# Altium project PCB_Project_1.PrjPcb
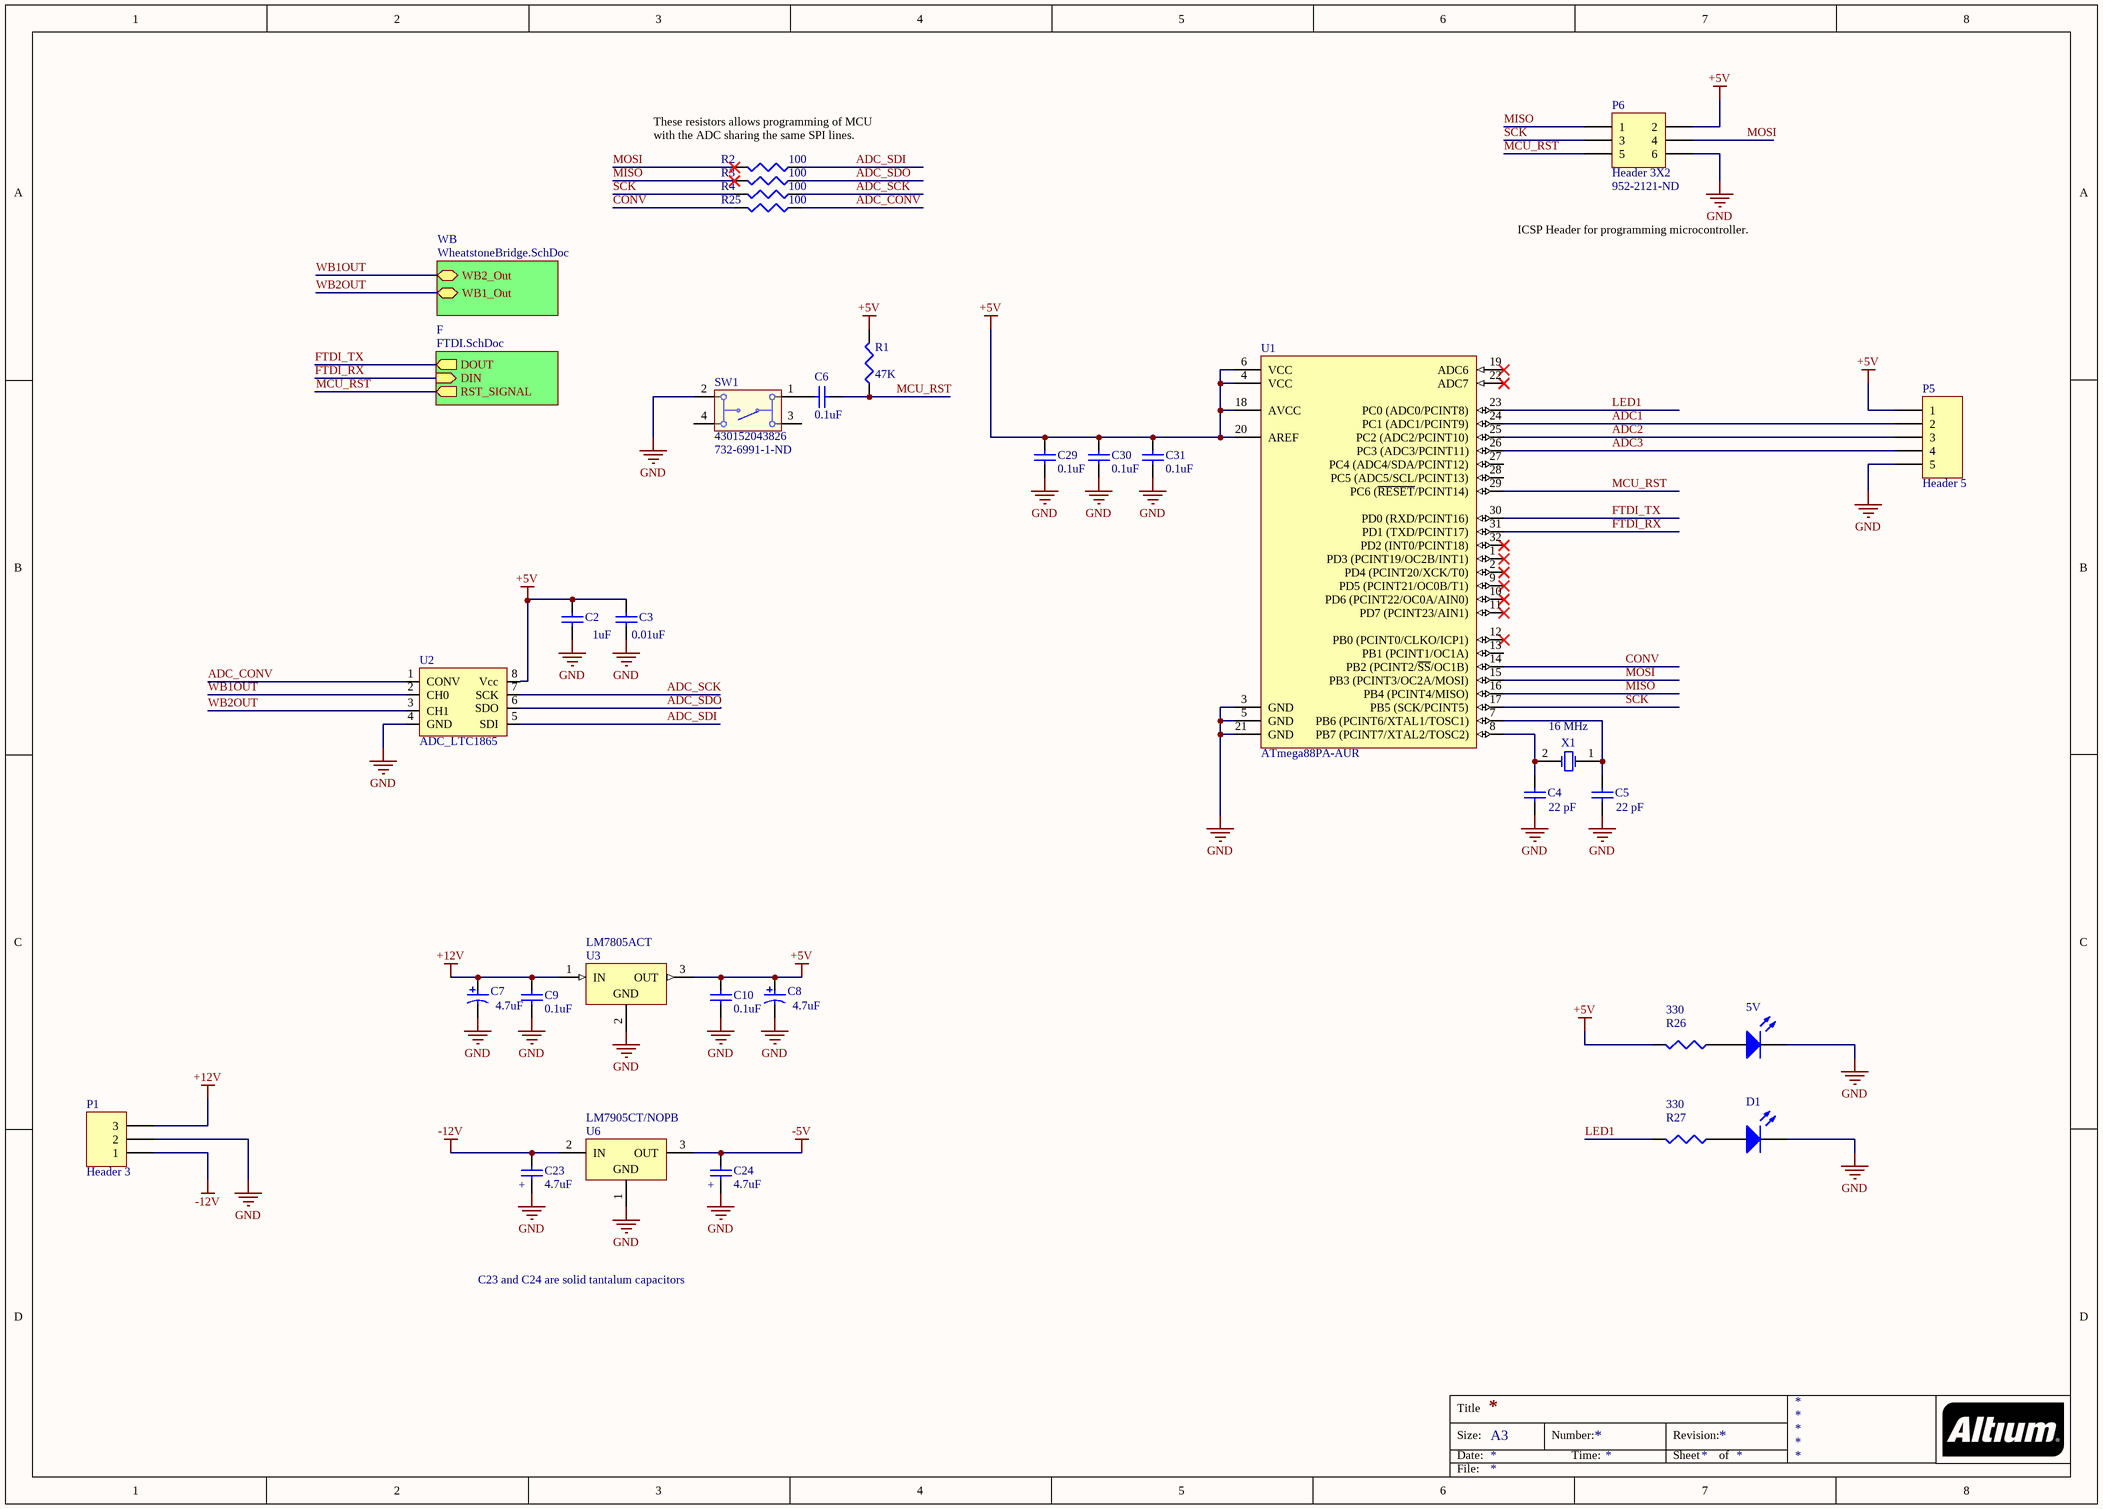
[diagram p0: Sheet1.SchDoc]
4 sheets, 74 parts. Net scope: hierarchical (ports join the sheet entries above them; power ports are global).
Board file: DualWheatstoneAmplifierV1.PcbDoc
Sheets:
  Sheet1.SchDoc
    WB = WheatstoneBridge.SchDoc
      Amp1 = WheatstonePrimaryAmplifier.SchDoc
      Amp2 = WheatstonePrimaryAmplifier.SchDoc
    F = FTDI.SchDoc

## Sheet Sheet1.SchDoc
size A3; PageSetup: Record=PageOptions|CenterHorizontal=True|CenterVertical=True|PrintScale=1.00|XCorrection=1.00|YCorrection=1.00|PrintKind=1|BorderSize=5000000|LeftOffset=0|BottomOffset=0|Orientation=2|PaperLength=1000|PaperWidth=1000|Scale=100|PaperSource=7|PrintQuality=-3|MediaType=1|DitherType=10|PrintScaleMode=1|PaperKind=A4|PaperIndex=9

### Parts
5V  150060RS75000  [0603_A]  (value not drawn)
C2  value 1uF  [1608[0603]]  (hidden comment: Cap Semi)
C3  value 0.01uF  [1608[0603]]  (hidden comment: Cap Semi)
C4  value 22 pF  [1608[0603]]  (hidden comment: Cap Semi)
C5  value 22 pF  [1608[0603]]  (hidden comment: Cap Semi)
C6  value 0.1uF  [1608[0603]]  (hidden comment: Cap Semi)
C7  Capacitance: 4.7uF  [AVX-TAJ-A-2_N]  (hidden comment: TAJA475K016RNJ)
C8  Capacitance: 4.7uF  [AVX-TAJ-A-2_N]  (hidden comment: TAJA475K016RNJ)
C9  value 0.1uF  [1608[0603]]  (hidden comment: Cap Semi)
C10  value 0.1uF  [1608[0603]]  (hidden comment: Cap Semi)
C23  value 4.7uF  [1608[0603]]  (hidden comment: Cap Semi)
C24  value 4.7uF  [1608[0603]]  (hidden comment: Cap Semi)
C29  value 0.1uF  [1608[0603]]  (hidden comment: Cap Semi)
C30  value 0.1uF  [1608[0603]]  (hidden comment: Cap Semi)
C31  value 0.1uF  [1608[0603]]  (hidden comment: Cap Semi)
D1  150060RS75000  [0603_A]  (value not drawn)
P1  Header 3  [HDR1X3]
P5  Header 5  [HDR1X5]
P6  Header 3X2  Supplier Part Number 1: 952-2121-ND  [HDR2X3]
R1  value 47K  [J1-0603]  (hidden comment: Res3)
R2  value 100  [J1-0603]  (hidden comment: Res3)
R3  value 100  [J1-0603]  (hidden comment: Res3)
R4  value 100  [J1-0603]  (hidden comment: Res3)
R25  value 100  [J1-0603]  (hidden comment: Res3)
R26  value 330  [J1-0603]  (hidden comment: Res3)
R27  value 330  [J1-0603]  (hidden comment: Res3)
SW1  430152043826  Supplier Part Number 1: 732-6991-1-ND  [430152043826]
U1  ATmega88PA-AUR  [32A_N]
U2  ADC_LTC1865  [LTC1865_SOIC8]
U3  LM7805ACT  [FAIR-TO-220-3]
U6  LM7905CT/NOPB  [NDE0003A]
X1  Frequency: 16 MHz  [ABRA-ABLS2-2_V]  (hidden comment: ABLS2-16.000MHZ-D4Y-T)

### Sub-sheets
F = FTDI.SchDoc: DOUT (out), RST_SIGNAL (out), DIN (in)
WB = WheatstoneBridge.SchDoc: WB1_Out, WB2_Out

### Nets
+5V: C2.1 C3.1 C8.1 C10.1 C29.1 C30.1 C31.1 P5.1 P6.2 R1.2 R26.2 U1.4(VCC) U1.6(VCC) U1.18(AVCC) U1.20(AREF) U2.8(Vcc) U3.3(OUT)
+12V: C7.1 C9.1 P1.3 U3.1(IN)
-5V: C24.1 U6.3(OUT)
-12V: C23.1 P1.1 U6.2(IN)
GND: 5V.1(K) C2.2 C3.2 C4.1 C5.1 C7.2 C8.2 C9.2 C10.2 C23.2 C24.2 C29.2 C30.2 C31.2 D1.1(K) P1.2 P5.5 P6.6 SW1.2 U1.3(GND) U1.5(GND) U1.21(GND) U2.4(GND) U3.2(GND) U6.1(GND)
ADC1: P5.2 U1.24(PC1_(ADC1/PCINT9))
ADC2: P5.3 U1.25(PC2_(ADC2/PCINT10))
ADC3: P5.4 U1.26(PC3_(ADC3/PCINT11))
ADC_CONV: R25.1 U2.1(CONV)
ADC_SCK: R4.1 U2.7(SCK)
ADC_SDI: R2.1 U2.5(SDI)
ADC_SDO: R3.1 U2.6(SDO)
CONV: R25.2 U1.14(PB2_(PCINT2/~{SS}/OC1B))
FTDI_RX: U1.31(PD1_(TXD/PCINT17)) ; sheet F/DIN
FTDI_TX: U1.30(PD0_(RXD/PCINT16)) ; sheet F/DOUT
LED1: R27.2 U1.23(PC0_(ADC0/PCINT8))
MCU_RST: C6.1 P6.5 R1.1 U1.29(PC6_(~{RESET}/PCINT14)) ; sheet F/RST_SIGNAL  [project net FTDI_RST]
MISO: P6.1 R3.2 U1.16(PB4_(PCINT4/MISO))
MOSI: P6.4 R2.2 U1.15(PB3_(PCINT3/OC2A/MOSI))
SCK: P6.3 R4.2 U1.17(PB5_(SCK/PCINT5))
WB1OUT: U2.2(CH0) ; sheet WB/WB2_Out
WB2OUT: U2.3(CH1) ; sheet WB/WB1_Out  [project net WB1]
Net5V_2: 5V.2(A) R26.1
NetC4_2: C4.2 U1.8(PB7_(PCINT7/XTAL2/TOSC2)) X1.2(X2)
NetC5_2: C5.2 U1.7(PB6_(PCINT6/XTAL1/TOSC1)) X1.1(X1)
NetC6_2: C6.2 SW1.1
NetD1_2: D1.2(A) R27.1

Not connected (* = marked no-connect by the designer): SW1 3 4; U1 1(PD3_(PCINT19/OC2B/INT1))* 2(PD4_(PCINT20/XCK/T0))* 9(PD5_(PCINT21/OC0B/T1))* 10(PD6_(PCINT22/OC0A/AIN0))* 11(PD7_(PCINT23/AIN1))* 12(PB0_(PCINT0/CLKO/ICP1))* 13(PB1_(PCINT1/OC1A)) 19(ADC6)* 22(ADC7)* 27(PC4_(ADC4/SDA/PCINT12)) 28(PC5_(ADC5/SCL/PCINT13)) 32(PD2_(INT0/PCINT18))*

### Notes on the sheet
- These resistors allows programming of MCU with the ADC sharing the same SPI lines.
- ICSP Header for programming microcontroller.
- (near C23) +
- (near C24) +
- C23 and C24 are solid tantalum capacitors
- Title
- Size:
- Date:
- A3
- Number:
- Time:
- Revision:
- Sheet
- of
- File:

### Library data of the parts
5V D1 = CMP-1426-00001-1: SMD mono-color Chip LED, WL-SMCW, Red; Manufacturer: Wuerth Elektronik; Color: Red; PackageReference: 0603_A; ComponentLink2URL: http://katalog.we-online.com/led/datasheet/150060RS75000.pdf; ComponentLink1URL: http://www.we-online.com; ComponentLink1Description: Manufacturer URL; ComponentLink2Description: Datasheet; PartNumber: 150060RS75000; Supplier 1: Digi-Key; Supplier Part Number 1: 732-4978-1-ND
C2-C6 C9 C10 C23 C24 C29-C31 = Cap Semi: Capacitor (Semiconductor SIM Model); Published: 8-Jun-2000; LatestRevisionDate: 29-May-2009; LatestRevisionNote: IPC-7351 Footprint Added.; PackageReference: C1206; Publisher: Altium Limited; PackageDescription: Chip Capacitor; Supplier 1: Digi-Key
  C2 C3 C6 C9 C10 C23 C24 C29-C31: Supplier Part Number 1: 490-10901-1-ND
  C4 C5: Supplier Part Number 1: 478-1166-1-ND
C7 C8 = CMP-2100-03687-1: Standard Tantalum, 4.7 uF, +/- 10%, 16 V, -55 to 125 degC, 2-Pin SMD (1206), RoHS, Tape and Reel; Manufacturer: AVX; Dissipation Factor: 6%; Voltage Rating: 16V; Polarity: Polar; Resistance: 4Ohm; Leakage Current: 800nA; Lead Free: LeadFree; Radiation Hardening: No; Depth: 1.6mm; Package Description: 2-Pin Surface Mount Device, Body 3.2 x 1.65 mm; Package Quantity: 1; Max Operating Temperature: 125degC; Case/Package: 1206; Min Operating Temperature: -55degC; Datasheet URL: http://datasheets.avx.com/TAJ.pdf; Termination: SMD/SMT; Length: 3.2mm; Manufacturer URL: http://www.avx.com/; Height - Seated (Max): 0.071inch; Packaging: TapeandReel; Package Reference: TAJ-A-2; RoHSCompliant: True; Datasheet Version: 42401.0; Voltage Rating (DC): 16V; REACH SVHC: NoSVHC; ESR (Equivalent Series Resistance): 4Ohm; Tolerance: 10%; Case Code (Metric): 3216; Voltage: 16V; Height: 1.6mm; Number of Pins: 2; Lead Pitch: 1.1mm; Dielectric Material: Tantalum; Case Code (Imperial): 1206; Width: 1.6mm
P1 = Header 3: Header, 3-Pin; LatestRevisionDate: 17-Jul-2002; LatestRevisionNote: Re-released for DXP Platform.; Publisher: Altium Limited
P5 = Header 5: Header, 5-Pin; LatestRevisionDate: 17-Jul-2002; LatestRevisionNote: Re-released for DXP Platform.; Publisher: Altium Limited
P6 = Header 3X2: Header, 3-Pin, Dual row; LatestRevisionDate: 17-Jul-2002; LatestRevisionNote: Re-released for DXP Platform.; Publisher: Altium Limited; Supplier 1: Digi-Key
R1-R4 R25-R27 = Res3: Resistor; Published: 8-Jun-2000; LatestRevisionDate: 29-May-2009; LatestRevisionNote: IPC-7351 Footprint Added.; PackageReference: J1-0603; Publisher: Altium Limited; PackageDescription: Chip Resistor; Supplier 1: Digi-Key
  R1: Supplier Part Number 1: 311-47.0KHRCT-ND
  R2-R4 R25: Supplier Part Number 1: 311-100HRCT-ND
  R26 R27: Supplier Part Number 1: 311-330HRCT-ND
SW1 = CMP-1452-00001-1: WS-TASV SMD Tact Switch 6X6 mm; Manufacturer: Wuerth Elektronik; NoPins: 04; PartNumber: 430152043826; ComponentLink2Description: Datasheet; ComponentLink1Description: Manufacturer URL; ComponentLink1URL: http://www.we-online.com; ComponentLink2URL: http://katalog.we-online.de/em/datasheet/4301x2.pdf; PackageReference: 430152043826; Supplier 1: Digi-Key
U1 = CMP-0095-00212-2: 8-bit AVR Microcontroller, 8KB Flash, 512 Bytes EEPROM, 1KB SRAM, 32-pin TQFP, Industrial Grade (-40°C to 85°C), Reel; ComponentLink1URL: http://www.atmel.com/; DatasheetVersion: revD, May-2011; ComponentLink3Description: ATmega48A/48PA/88A/88PA/168A/168PA/328/328P Summary; PackageDescription: 32-Lead, 7x7x1.0 mm Body, 0.8mm Lead Pitch, Thin Profile Plastic Quad Flat Package (TQFP); ComponentLink1Description: Manufacturer URL; ComponentLink3URL: http://www.atmel.com/dyn/resources/prod_documents/8271S.pdf; ComponentLink2URL: http://www.atmel.com/dyn/resources/prod_documents/doc8271.pdf; PackageReference: 32A; RevisionNote: DatasheetVersion & PackageVersion updated. URLs added.; ComponentLink2Description: ATmega48A/48PA/88A/88PA/168A/168PA/328/328P Datasheet; Code_JEDEC: MS-026-ABA; PackageVersion: revC, Oct-2010
U3 = CMP-2000-04937-1: Positive Voltage Regulator, 5 V, 1 A, 0 to 125 degC, 3-Pin TO-220, RoHS, Tube; Manufacturer: Fairchild; Number of Outputs: 1; Typical Dropout Voltage @ Current: 2V@1A; Output Type: Fixed; Output Voltage: 5V; Quiescent Current: 6mA; Dropout Voltage Measurement Current: 1A; Line Regulation: 50mV; Maximum Input Voltage: 35V; Regulator Function: Linear; Load Regulation: 100mV; Package Type: TO-220; Mounting Type: ThroughHole; Height: 16.51mm; Maximum Operating Temperature: +125degC; Datasheet Version: Rev. 1.0.1, 05/2006; Package Reference: TO-220; Minimum Operating Temperature: 0degC; Manufacturer URL: https://www.fairchildsemi.com/; Package URL: https://www.fairchildsemi.com/package-drawings/TO/TO220B03.pdf; Length: 10.67mm; Series: LM78xx; Dimensions: 10.67x4.83x16.51mm; Polarity: Positive; Maximum Output Current: 1A; Pin Count: 3; Width: 4.83mm; Package Description: 3-Pin Through Hole Device, Body 10 x 4.5 mm, Pitch 2.54 mm; Datasheet URL: https://datasheet.ciiva.com/5816/1359194-5816420.pdf
U6 = CMP-0062-02481-3: 3-Terminal Negative Regulator, 3-pin TO-220, Pb-Free; Manufacturer: Texas Instruments; PackageTopMarking: NSUZXYTTE#*LM7905CT; CompType: LDO IC; PowerWise: N; PackageDescription: TO-220, Molded, 3 Lead, Straight; ComponentLink1Description: Datasheet URL; ComponentLink1URL: http://www.ti.com/general/docs/lit/getliterature.tsp?genericPartNumber=LM7905&fileType=pdf; PackageReference: NDE0003A; RoHS: Y; PinCount: 3
X1 = CMP-0277-00002-1: Low Profile Surface Mount Microprocessor Crystal, 16.000 MHz +/-30 ppm, 180 Ohm, -40 to 85 degC, 2-Pin 11.4 x 4.7 x 3.3 mm SMD, RoHS, Tape and Reel; Manufacturer: Abracon; Operation Mode: Fundamental or 3rd Overtone; Shunt Capacitance: 7 pF Max.; ESR: 180 Ohm; Load Capacitance: 18 pF; Mounting Technology: Surface Mount; PackageDescription: 2-Pin SMD, Body 11.4 x 4.7 mm, Height 3.3 mm; ComponentLink1URL: http://www.abracon.com/; Freq. Stability: +/- 30 ppm; ComponentLink2Description: Datasheet; PartNumber: ABLS2-16.000MHZ-D4Y-T; Operating Temp. Range: -40 to 85 degC; Packing: Tape and Reel; RoHS: TRUE; PackageReference: ABLS2-2; DatasheetVersion: Rev. 03.31.11; Freq. Tolerance: +/- 30 ppm; ComponentLink2URL: http://www.abracon.com/Resonators/ABLS2.pdf; ComponentLink1Description: Manufacturer URL; Supplier 1: Digi-Key; Supplier Part Number 1: 535-9875-1-ND

## Sheet WheatstoneBridge.SchDoc
size A3
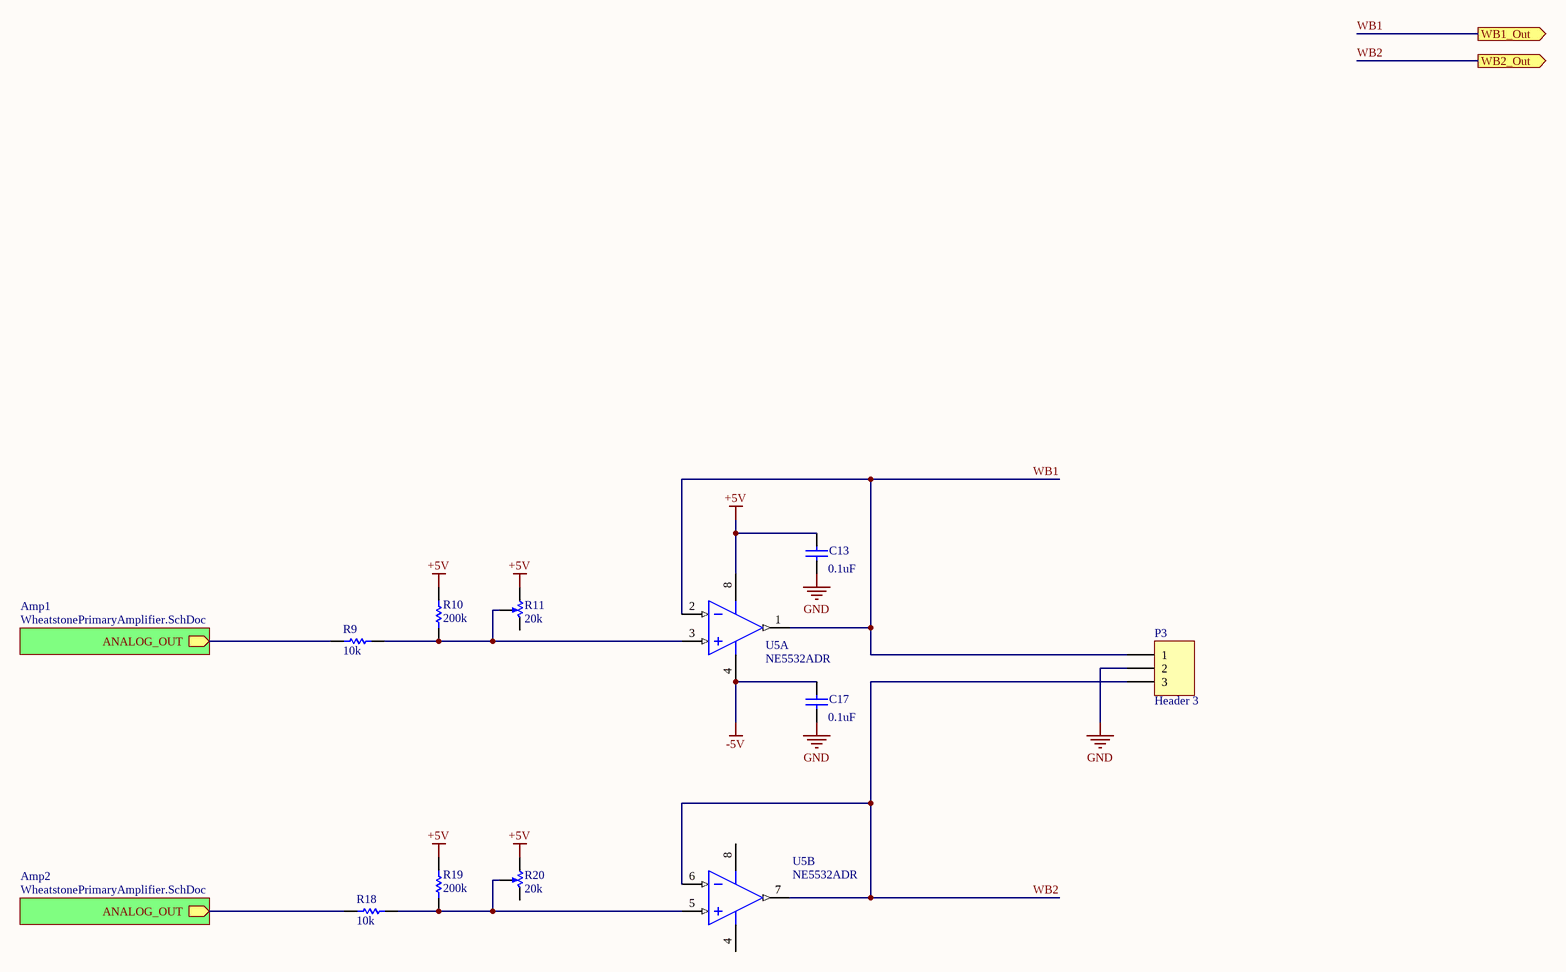
[diagram p1: WheatstoneBridge.SchDoc]

### Parts
C13  value 0.1uF  [1608[0603]]  (hidden comment: Cap Semi)
C17  value 0.1uF  [1608[0603]]  (hidden comment: Cap Semi)
P3  Header 3  [HDR1X3]
R9  10k  [RESC1608X55X25ML10T15]
R10  200k  [RESC1608X55X25ML10T15]
R11  20k  [Trimpot_Cut_tape_3.4x3.4x2]
R18  10k  [RESC1608X55X25ML10T15]
R19  200k  [RESC1608X55X25ML10T15]
R20  20k  [Trimpot_Cut_tape_3.4x3.4x2]
U5  NE5532ADR  [D0008A_M]  (parts A,B of 2)

### Sub-sheets
Amp1 = WheatstonePrimaryAmplifier.SchDoc: ANALOG_OUT (out)
Amp2 = WheatstonePrimaryAmplifier.SchDoc: ANALOG_OUT (out)

### Ports
WB1_Out (out), WB2_Out (out)

### Nets
+5V: C13.1 R10.1 R11.1 R19.1 R20.1 U5.8(VCC+)
-5V: C17.1 U5.4(VCC-)
GND: C13.2 C17.2 P3.2
ANALOG_OUT: R9.2 ; sheet Amp1/ANALOG_OUT
ANALOG_OUT: R18.2 ; sheet Amp2/ANALOG_OUT  [a separate net that carries the same name]
WB1: P3.1 U5.1(OUT1) U5.2(IN1-) ; port WB1_Out
WB2: P3.3 U5.6(IN2-) U5.7(OUT2) ; port WB2_Out  [project net WB1OUT]
NetR9_1: R9.1 R10.2 R11.2 U5.3(IN1+)
NetR18_1: R18.1 R19.2 R20.2 U5.5(IN2+)

Not connected (* = marked no-connect by the designer): R11 3; R20 3

### Notes on the sheet
- Title
- Size:
- Date:
- A3
- Number:
- Time:
- Revision:
- Sheet
- of
- File:

### Library data of the parts
C13 C17 = Cap Semi: Capacitor (Semiconductor SIM Model); Published: 8-Jun-2000; LatestRevisionDate: 29-May-2009; LatestRevisionNote: IPC-7351 Footprint Added.; PackageReference: C1206; Publisher: Altium Limited; PackageDescription: Chip Capacitor; Supplier 1: Digi-Key; Supplier Part Number 1: 490-10901-1-ND
P3 = Header 3: Header, 3-Pin; LatestRevisionDate: 17-Jul-2002; LatestRevisionNote: Re-released for DXP Platform.; Publisher: Altium Limited
R9 R10 R18 R19 = CMP-1659-00009-3: Chip Resistor, 1 KOhm, +/-1%, 0.1 W, -55 to 155 degC, 0603 (1608 Metric), RoHS, Tape and Reel; Voltage Rating: 50 V; PackageReference: 0603; Packaging: Tape and Reel; DatasheetVersion: Rev. 4, 02/2016; REACH SVHC: No SVHC; Height: 0.45 mm; Pins: 2; Length: 1.6 mm; Max Operating Temperature: 155 degC; Mounting Technology: Surface Mount; Mount: Surface Mount; Package Quantity: 200; Min Operating Temperature: -55 degC; RoHSCompliant: true; PackageDescription: 2-Pin Surface Mount Device, Body 1.6 x 0.8 mm
R11 R20 = Component_1
U5 = CMP-0017-00450-2: Dual Low-Noise Operational Amplifier, 10 to 30 V, 0 to 70 degC, 8-pin SOIC (D8), Green (RoHS & no Sb/Br); Manufacturer: Texas Instruments; Total Supply Voltage(Min)(+5V is 5, +/-5V is 10): 10; Slew Rate(Typ)(V/us): 9; Sub Family: General Purpose Amplifier, High Supply Voltage Amplifier (>=30V), Low Noise Amp (<=10nV/rtHz); Vio (25C)(Max)(mV): 4; IIB(Max)(pA): 800000; Vn at 1kHz(Typ)(nV/rtHz): 5; Number of Channels: 2; Total Supply Voltage(Max)(+5V is 5, +/-5V is 10): 30; CMRR(Min)(dB): 70; Code_JEDEC: MS-012; ComponentLink1URL: http://www.ti.com/; DatasheetVersion: SLOS075I; PackageDescription: 8-Pin Plastic Small Outline, Body 4.9 x 3.9 mm, Pitch 1.27 mm; Eco-Plan: Green (RoHS & no Sb/Br); ComponentLink3Description: Package Specification; PackageReference: D0008A; Mounting Technology: Surface Mount; GBW(Typ)(MHz): 10; ComponentLink2Description: Datasheet; ComponentLink1Description: Manufacturer URL; PartNumber: NE5532ADR; ComponentLink3URL: http://www.ti.com/litv/pdf/msoi002j; PackageVersion: 4040047-3/M, 06/2011; ComponentLink2URL: http://www.ti.com/lit/ds/symlink/ne5532a.pdf; Iq per channel(Max)(mA): 4

## Sheet WheatstonePrimaryAmplifier.SchDoc
size A3
Used 2 times, as channels WB/Amp1, WB/Amp2. Parts and nets are listed once, with the designators drawn on the sheet.
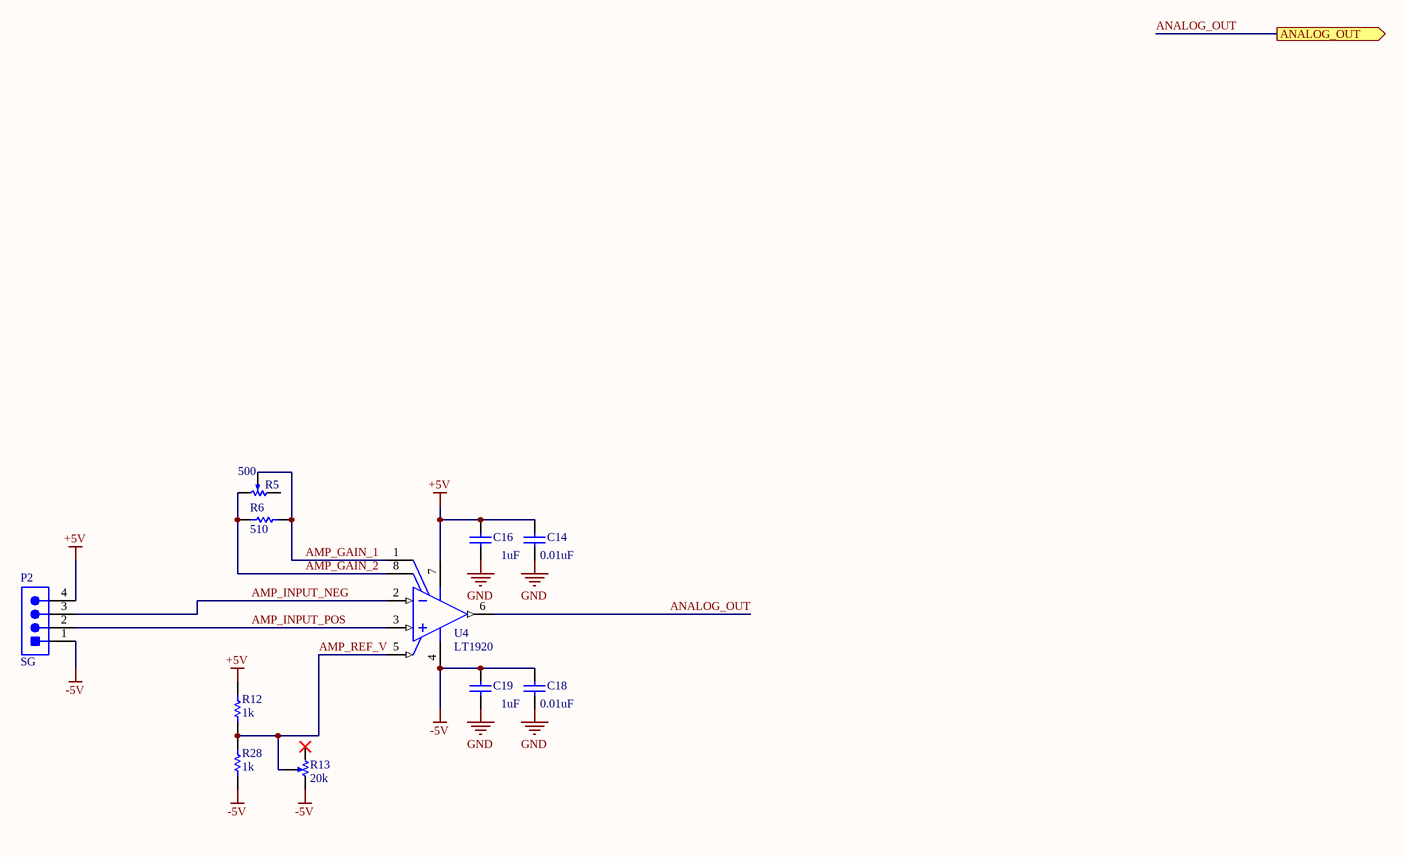
[diagram p2: WheatstonePrimaryAmplifier.SchDoc]

### Parts
C14  value 0.01uF  [1608[0603]]  (hidden comment: Cap Semi)
C16  value 1uF  [1608[0603]]  (hidden comment: Cap Semi)
C18  value 0.01uF  [1608[0603]]  (hidden comment: Cap Semi)
C19  value 1uF  [1608[0603]]  (hidden comment: Cap Semi)
P2  SG  [TECO-5-103414-2_V]
R5  500  [Trimpot_Cut_tape_3.4x3.4x2]
R6  510  [RESC0603(1608)_L]
R12  1k  [RESC1608X55X25ML10T15]
R13  20k  [Trimpot_Cut_tape_3.4x3.4x2]
R28  1k  [RESC1608X55X25ML10T15]
U4  LT1920  [LT-S8-8_L]

### Ports
ANALOG_OUT (out)

### Nets
+5V: C14.1 C16.1 P2.4 R12.2 U4.7(+VS)
-5V: C18.1 C19.1 P2.1 R13.3 R28.1 U4.4(-VS)
GND: C14.2 C16.2 C18.2 C19.2
AMP_GAIN_1: R5.2 R6.2 U4.1(RG)
AMP_GAIN_2: R5.3 R6.1 U4.8(RG)
AMP_INPUT_NEG: P2.3 U4.2(-IN)
AMP_INPUT_POS: P2.2 U4.3(+IN)
AMP_REF_V: R12.1 R13.2 R28.2 U4.5(REF)
ANALOG_OUT: U4.6(OUTPUT) ; port ANALOG_OUT

Not connected (* = marked no-connect by the designer): R5 1; R13 1*

### Channels
WB/Amp1: designators end in _Amp1; ports ANALOG_OUT=ANALOG_OUT
WB/Amp2: designators end in _Amp2; ports ANALOG_OUT=ANALOG_OUT

### Notes on the sheet
- Title
- Size:
- Date:
- A3
- Number:
- Time:
- Revision:
- Sheet
- of
- File:

### Library data of the parts
C14 C16 C18 C19 = Cap Semi: Capacitor (Semiconductor SIM Model); Published: 8-Jun-2000; LatestRevisionDate: 29-May-2009; LatestRevisionNote: IPC-7351 Footprint Added.; PackageReference: C1206; Publisher: Altium Limited; PackageDescription: Chip Capacitor; Supplier 1: Digi-Key; Supplier Part Number 1: 490-10901-1-ND
P2 = CMP-2000-05625-1: Male Header, Pitch 2.54 mm, 1 x 4 Position, Height 14.199 mm, Tail Length 3.302 mm, -55 to 105 degC, RoHS, Rail/Tube; Manufacturer: TE Connectivity; 3D Model: 5-103414-2.pdf; Connector Type: Header,Shrouded; Mating Products: A34951-ND / -CONNRECEPTACLE4POS.10015AU / 103979-3-ND / -CONNRCPT4POS.100GOLD / 103978-3-ND / -CONNRCPT4POS.100GOLD / A34180-ND / -CONNRECEPTACLE4POS.100TIN / A34179-ND / -CONNRECEPTACLE4POS.10030AU / 104439-3-ND / -CONNRCPT4POS.10022-2630AU / 487769-2-ND / -SKTCONNW/DETENT4POSFLATFLX / A28358-ND / -CONNRECEPTACLE4POS.10015AU / A28357-ND / -CONNRECEPTACLE4POS.10030AU / A28360-ND / -CONNRECEPTACLE4POS.1"UNLOAD / More...; Dynamic Catalog: AMPMODUModIISeries; Pitch: 0.100"(2.54mm); Other Names: A32979; Featured Product: AMPMODUConnectors; Catalog Drawings: ShroudedSquareStraight / ShroudedStraightSide; Number of Positions: 4; Number of Positions Loaded: All; Contact Mating Length: 0.240"(6.10mm); Color: Black; Mounting Type: ThroughHole; Contact Finish: Gold; Package Description: Male Header, Pitch 2.54 mm, 1 x 4 Position, Height 14.199 mm, Tail Length 3.302 mm; Series: AMPMODUModII; Family: RectangularConnectors-Headers,MalePins; Packaging: Tube; Contact Type: MalePin; Standard Package: 40; Mounting Technology: ThroughHole; Datasheet Version: Rev. P2, 03/2011; RoHS Information: 5-103414-2StatementofCompliance; Package Reference: 5-103414-2; Number of Rows: 1; Datasheet URL: http://www.te.com/commerce/DocumentDelivery/DDEController?Action=srchrtrv&DocNm=103414&DocType=Customer+Drawing&DocLang=English&DocFormat=pdf&PartCntxt=5-103414-2; Contact Finish Thickness: 30µin(0.76µm); Termination: Solder; Manufacturer URL: http://www.te.com/; Category: Connectors,Interconnects
R5 R13 = Component_1
R6 = CMP-1012-00067-1: 510R 0.1W 5% 0603 (1608 Metric)  SMD; Case-EIA: 0603; Value: 510.00 Ohm; Case-Metric: 1608; Technology: SMT; Power: 0.1 W; Tolerance: 5 %
R12 R28 = CMP-1659-00009-3: as R9 on sheet WheatstoneBridge; PackageReference: 0603; Packaging: Tape and Reel; DatasheetVersion: Rev. 4, 02/2016; REACH SVHC: No SVHC; Height: 0.45 mm; Pins: 2; Length: 1.6 mm; Max Operating Temperature: 155 degC; Mounting Technology: Surface Mount; Mount: Surface Mount; Package Quantity: 200; Min Operating Temperature: -55 degC; RoHSCompliant: true; PackageDescription: 2-Pin Surface Mount Device, Body 1.6 x 0.8 mm
U4 = CMP-0359-03370-2: Single Channel, Resistor Gain Programmable, Precision Instrumentation Operational Amplifier, 0.8 MHz Typical GBW, 1.2 V/us Typical SR, 4.6 to 40 V, 8-Pin SOIC (S8-8), Commercial, Pb-Free; Manufacturer: Linear Technology; PartNumber: LT1920CS8#PBF; GBW (MHz) Typical: 0.8; Vs Min (V): 4.6; Vs Max (V): 40; SR (V/us) Typical: 1.2; Channels (#): 1; Vos (mV) Typical: 0.03; Is (mA) Typical: 0.9; Vos (mV) Guaranteed: 0.125; ComponentLink1Description: Manufacturer URL; ComponentLink3URL: http://cds.linear.com/docs/en/packaging/05081610_G_SO8.pdf; ComponentLink1URL: http://www.linear.com/; ComponentLink3Description: Package Specification; PackageReference: LT-S8-8; Mounting Technology: Surface Mount; PackageVersion: Rev G; RevisionNote: URLs updated; PackageDescription: 8-Pin Plastic Small Outline, Body 4.9 x 3.9 mm, Pitch 1.27 mm; RoHS: Pb-Free; ComponentLink2Description: Datasheet; ComponentLink2URL: http://cds.linear.com/docs/en/datasheet/1920f.pdf; Linear Technology Part Number: LT1920; Type: IA

## Sheet FTDI.SchDoc
size A3
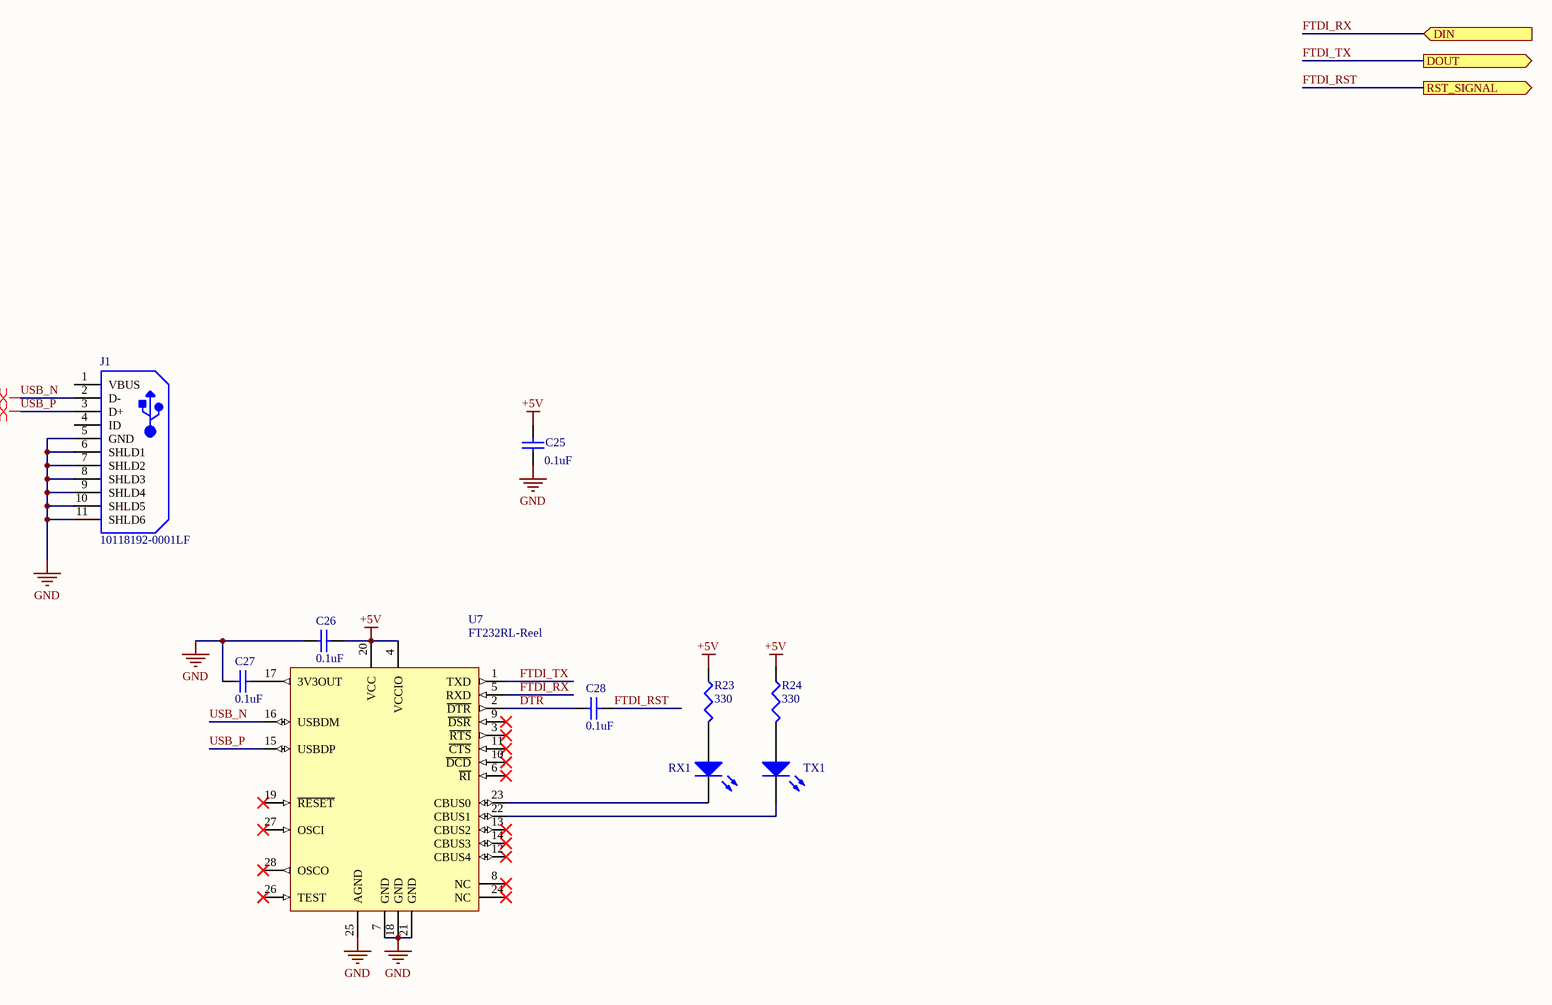
[diagram p3: FTDI.SchDoc]

### Parts
C25  value 0.1uF  [1608[0603]]  (hidden comment: Cap Semi)
C26  value 0.1uF  [1608[0603]]  (hidden comment: Cap Semi)
C27  value 0.1uF  [1608[0603]]  (hidden comment: Cap Semi)
C28  value 0.1uF  [1608[0603]]  (hidden comment: Cap Semi)
J1  10118192-0001LF  [FCI-10118192-0001LF-5_V]
R23  value 330  [J1-0603]  (hidden comment: Res3)
R24  value 330  [J1-0603]  (hidden comment: Res3)
RX1  150060RS75000  [0603_A]  (value not drawn)
TX1  150060RS75000  [0603_A]  (value not drawn)
U7  FT232RL-Reel  [SSOP-28_L]

### Ports
DIN (in), DOUT (out), RST_SIGNAL (out)

### Nets
+5V: C25.1 C26.2 R23.1 R24.1 U7.4(VCCIO) U7.20(VCC)
GND: C25.2 C26.1 C27.1 J1.5(GND) J1.6(SHLD1) J1.7(SHLD2) J1.8(SHLD3) J1.9(SHLD4) J1.10(SHLD5) J1.11(SHLD6) U7.7(GND) U7.18(GND) U7.21(GND) U7.25(AGND)
DTR: C28.1 U7.2(~{DTR})
FTDI_RST: C28.2 ; port RST_SIGNAL
FTDI_RX: U7.5(RXD) ; port DIN
FTDI_TX: U7.1(TXD) ; port DOUT
USB_N: J1.2(D-) U7.16(USBDM)
USB_P: J1.3(D+) U7.15(USBDP)
NetC27_2: C27.2 U7.17(3V3OUT)
NetR23_2: R23.2 RX1.2(A)
NetR24_2: R24.2 TX1.2(A)
NetRX1_1: RX1.1(K) U7.23(CBUS0)
NetTX1_1: TX1.1(K) U7.22(CBUS1)

Not connected (* = marked no-connect by the designer): J1 1(VBUS) 4(ID); U7 3(~{RTS})* 6(~{RI})* 8(NC)* 9(~{DSR})* 10(~{DCD})* 11(~{CTS})* 12(CBUS4)* 13(CBUS2)* 14(CBUS3)* 19(~{RESET})* 24(NC)* 26(TEST)* 27(OSCI)* 28(OSCO)*

### Layout directives
differential pair: USB_N, USB_P

### Notes on the sheet
- Title
- Size:
- Date:
- A3
- Number:
- Time:
- Revision:
- Sheet
- of
- File:

### Library data of the parts
C25-C28 = Cap Semi: Capacitor (Semiconductor SIM Model); Published: 8-Jun-2000; LatestRevisionDate: 29-May-2009; LatestRevisionNote: IPC-7351 Footprint Added.; PackageReference: C1206; Publisher: Altium Limited; PackageDescription: Chip Capacitor; Supplier 1: Digi-Key; Supplier Part Number 1: 490-10901-1-ND
J1 = CMP-2000-05118-1: Micro USB B Type Receptacle, -55 to 85 degC, 5-Pin SMD, RoHS, Tape and Reel; Manufacturer: FCI; Current Rating: 1.8A; Number of Contacts: 5Contact; Mounting Angle: Right; Insulation Resistance: 1000MOhms; Connector Type: MicroUSBTypeBreceptacle; Gender: Female; Packaging: Reel; Termination Style: SMD/SMT; Product Category: USBConnectors; RoHS: Details; Flammability Rating: UL94V-0; Standard: USB2.0; Brand: FCI; Manufacturer URL: http://www.fci.com/; Product: MicroUSBTypeBConnectors; Operating Temperature Range: -55Cto+85C; Datasheet Version: Rev. B, 05/2015; Contact Material: CopperAlloy; Contact Plating: Gold; Datasheet URL: http://www.mouser.com/ds/2/154/10118192-793027.pdf; Color: Black; Factory Pack Quantity: 1400
R23 R24 = Res3: Resistor; Published: 8-Jun-2000; LatestRevisionDate: 29-May-2009; LatestRevisionNote: IPC-7351 Footprint Added.; PackageReference: J1-0603; Publisher: Altium Limited; PackageDescription: Chip Resistor; Supplier 1: Digi-Key; Supplier Part Number 1: 311-330HRCT-ND
RX1 TX1 = CMP-1426-00001-1: as 5V on sheet Sheet1; Color: Red; PackageReference: 0603_A; ComponentLink2URL: http://katalog.we-online.com/led/datasheet/150060RS75000.pdf; ComponentLink1URL: http://www.we-online.com; ComponentLink1Description: Manufacturer URL; ComponentLink2Description: Datasheet; PartNumber: 150060RS75000; Supplier 1: Digi-Key; Supplier Part Number 1: 732-4978-1-ND
U7 = CMP-0078-00029-3: USB UART Asynchronous Serial Data Transfer Chip, 28-pin SSOP, Tape and Reel; Manufacturer: FTDI; PackageVersion: Mar-12; PackageReference: SSOP-28; ComponentLink2Description: Datasheet; DatasheetVersion: ver 2.10, Mar-2012; PackageDescription: 28-Pin Small Outline Package 0.65 mm Pitch; ComponentLink1Description: Manufacturer URL; RevisionNote: DatasheetVersion updated to 2.10 Mar-2012; PartNumber: FT232RL-Reel; ComponentLink1URL: http://www.ftdichip.com/; ComponentLink2URL: http://www.ftdichip.com/Support/Documents/DataSheets/ICs/DS_FT232R.pdf; Supplier 1: Digi-Key; Supplier Part Number 1: 768-1007-1-ND

## Nets that join several sheets
+5V: Sheet1 (17 pins), WheatstoneBridge (6 pins), WB/Amp1 (5 pins), WB/Amp2 (5 pins), FTDI (6 pins)
-5V: Sheet1 (C24.1 U6.3), WheatstoneBridge (C17.1 U5.4), WB/Amp1 (6 pins), WB/Amp2 (6 pins)
GND: Sheet1 (25 pins), WheatstoneBridge (C13.2 C17.2 P3.2), WB/Amp1 (C14_Amp1.2 C16_Amp1.2 C18_Amp1.2 C19_Amp1.2), WB/Amp2 (C14_Amp2.2 C16_Amp2.2 C18_Amp2.2 C19_Amp2.2), FTDI (14 pins)
ANALOG_OUT: WheatstoneBridge (R9.2), WB/Amp1 (U4_Amp1.6)
ANALOG_OUT: WheatstoneBridge (R18.2), WB/Amp2 (U4_Amp2.6)
FTDI_RST: Sheet1 (C6.1 P6.5 R1.1 U1.29), FTDI (C28.2)
FTDI_RX: Sheet1 (U1.31), FTDI (U7.5)
FTDI_TX: Sheet1 (U1.30), FTDI (U7.1)
WB1: Sheet1 (U2.3), WheatstoneBridge (P3.1 U5.1 U5.2)
WB1OUT: Sheet1 (U2.2), WheatstoneBridge (P3.3 U5.6 U5.7)